# EAGLE design Borne de satisfaction V0 (EAGLE 9.5.2)
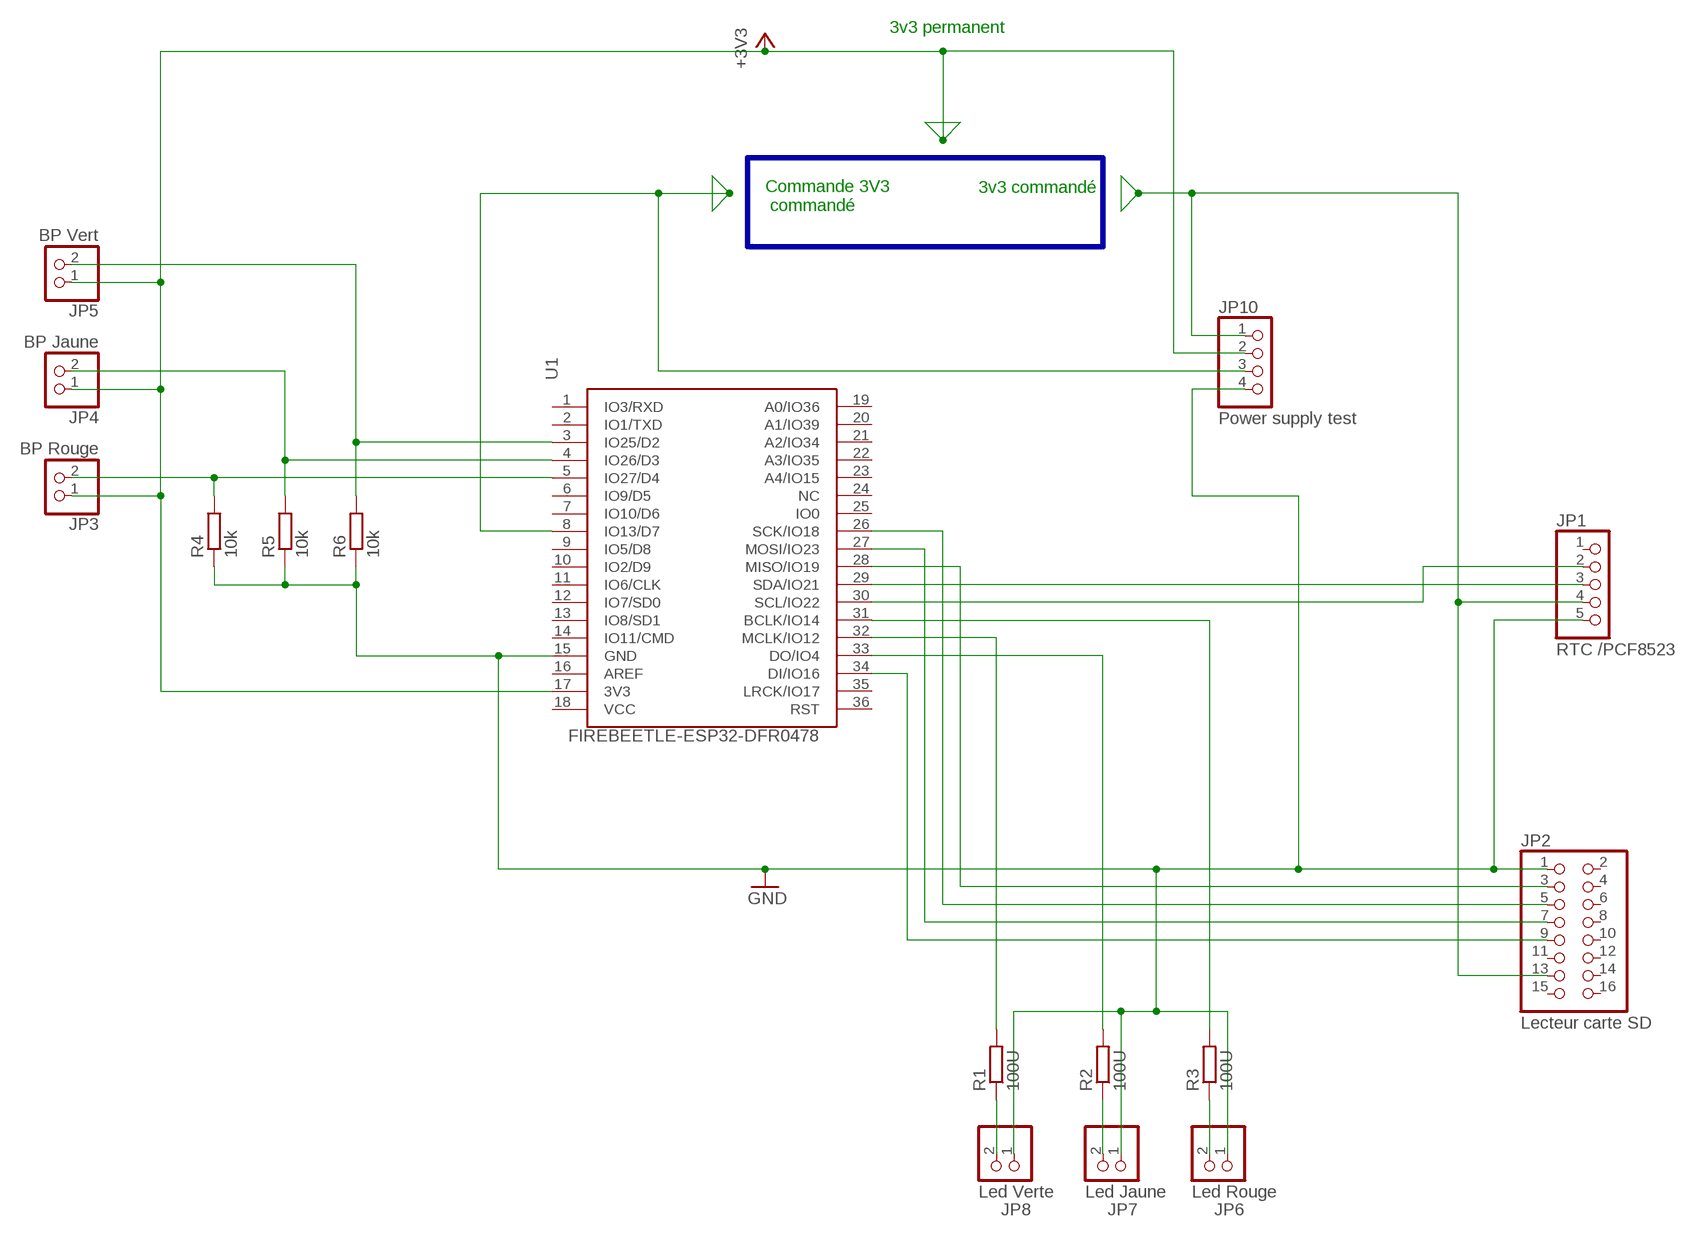
[diagram p0: schematic, sheet 1]

## Parts
JP1  RTC /PCF8523  PINHD-1X5  [1X05]
JP2  Lecteur carte SD  PINHD-2X8  [2X08]
JP3  BP Rouge  PINHD-1X2  [1X02]
JP4  BP Jaune  PINHD-1X2  [1X02]
JP5  BP Vert  PINHD-1X2  [1X02]
JP6  Led Rouge  PINHD-1X2  [1X02]
JP7  Led Jaune  PINHD-1X2  [1X02]
JP8  Led Verte  PINHD-1X2  [1X02]
JP10  Power supply test  PINHD-1X4  [1X04]
R1  100U  R-EU_0207/10  [0207/10]
R2  100U  R-EU_0207/10  [0207/10]
R3  100U  R-EU_0207/10  [0207/10]
R4  10k  R-EU_0207/10  [0207/10]
R5  10k  R-EU_0207/10  [0207/10]
R6  10k  R-EU_0207/10  [0207/10]
U1  FIREBEETLE-ESP32-DFR0478  [FIREBEETLE_ESP32]

## Nets
+3V3: JP3.1 JP4.1 JP5.1 JP10.2 U1.17(3V3)
GND: JP1.5 JP2.1 JP6.1 JP7.1 JP8.1 JP10.4 R4.1 R5.1 R6.1 U1.15(GND)
N$1: JP10.3 U1.8(IO13/D7)
N$2: JP2.3 U1.28(MISO/IO19)
N$3: JP2.5 U1.26(SCK/IO18)
N$4: JP2.7 U1.27(MOSI/IO23)
N$5: JP2.9 U1.34(DI/IO16)
N$6: JP1.4 JP2.13 JP10.1
N$7: JP3.2 R4.2 U1.5(IO27/D4)
N$8: JP1.2 U1.30(SCL/IO22)
N$9: JP1.3 U1.29(SDA/IO21)
N$10: JP8.2 R1.1
N$11: JP7.2 R2.1
N$12: JP6.2 R3.1
N$13: R1.2 U1.32(MCLK/IO12)
N$14: R3.2 U1.31(BCLK/IO14)
N$15: R2.2 U1.33(DO/IO4)
N$17: JP4.2 R5.2 U1.4(IO26/D3)
N$18: JP5.2 R6.2 U1.3(IO25/D2)
Unconnected: JP1.1 JP2.2 JP2.4 JP2.6 JP2.8 JP2.10 JP2.11 JP2.12 JP2.14 JP2.15 JP2.16 U1.1(IO3/RXD) U1.2(IO1/TXD) U1.6(IO9/D5) U1.7(IO10/D6) U1.9(IO5/D8) U1.10(IO2/D9) U1.11(IO6/CLK) U1.12(IO7/SD0) U1.13(IO8/SD1) U1.14(IO11/CMD) U1.16(AREF) U1.18(VCC) U1.19(A0/IO36) U1.20(A1/IO39) U1.21(A2/IO34) U1.22(A3/IO35) U1.23(A4/IO15) U1.24(NC) U1.25(IO0) U1.35(LRCK/IO17) U1.36(RST)

## Buses
B$1

## Notes on the sheet
- 3v3 permanent
- 3v3 commandé
- Commande 3V3
   commandé

## Library data of the parts
JP1 = pinhead:PINHD-1X5: PIN HEADER
JP2 = pinhead:PINHD-2X8: PIN HEADER
JP3-JP8 = pinhead:PINHD-1X2: PIN HEADER
JP10 = pinhead:PINHD-1X4: PIN HEADER
R1-R6 = rcl:R-EU_: RESISTOR, European symbol; SPICEPREFIX: R
U1 = Eagle_UOF_Lib:FIREBEETLE-ESP32-DFR0478: Development Boards & Kits - Wireless FireBeetle ESP32 IOT MCU Source: Datasheet <https://github.com/Robert-MARKII/Document/blob/master/FireBeetle Board-ESP32 User Manual update.pdf>; DESCRIPTION: Development Boards & Kits - Wireless FireBeetle ESP32 IOT MCU; HEIGHT: mm; MANUFACTURER_NAME: DFRobot; MANUFACTURER_PART_NUMBER: DFR0478; MOUSER_PART_NUMBER: 426-DFR0478; MOUSER_PRICE-STOCK: https://www.mouser.co.uk/ProductDetail/DFRobot/DFR0478?qs=EU6FO9ffTwc%252BR65h2NUGQw%3D%3D

## Board
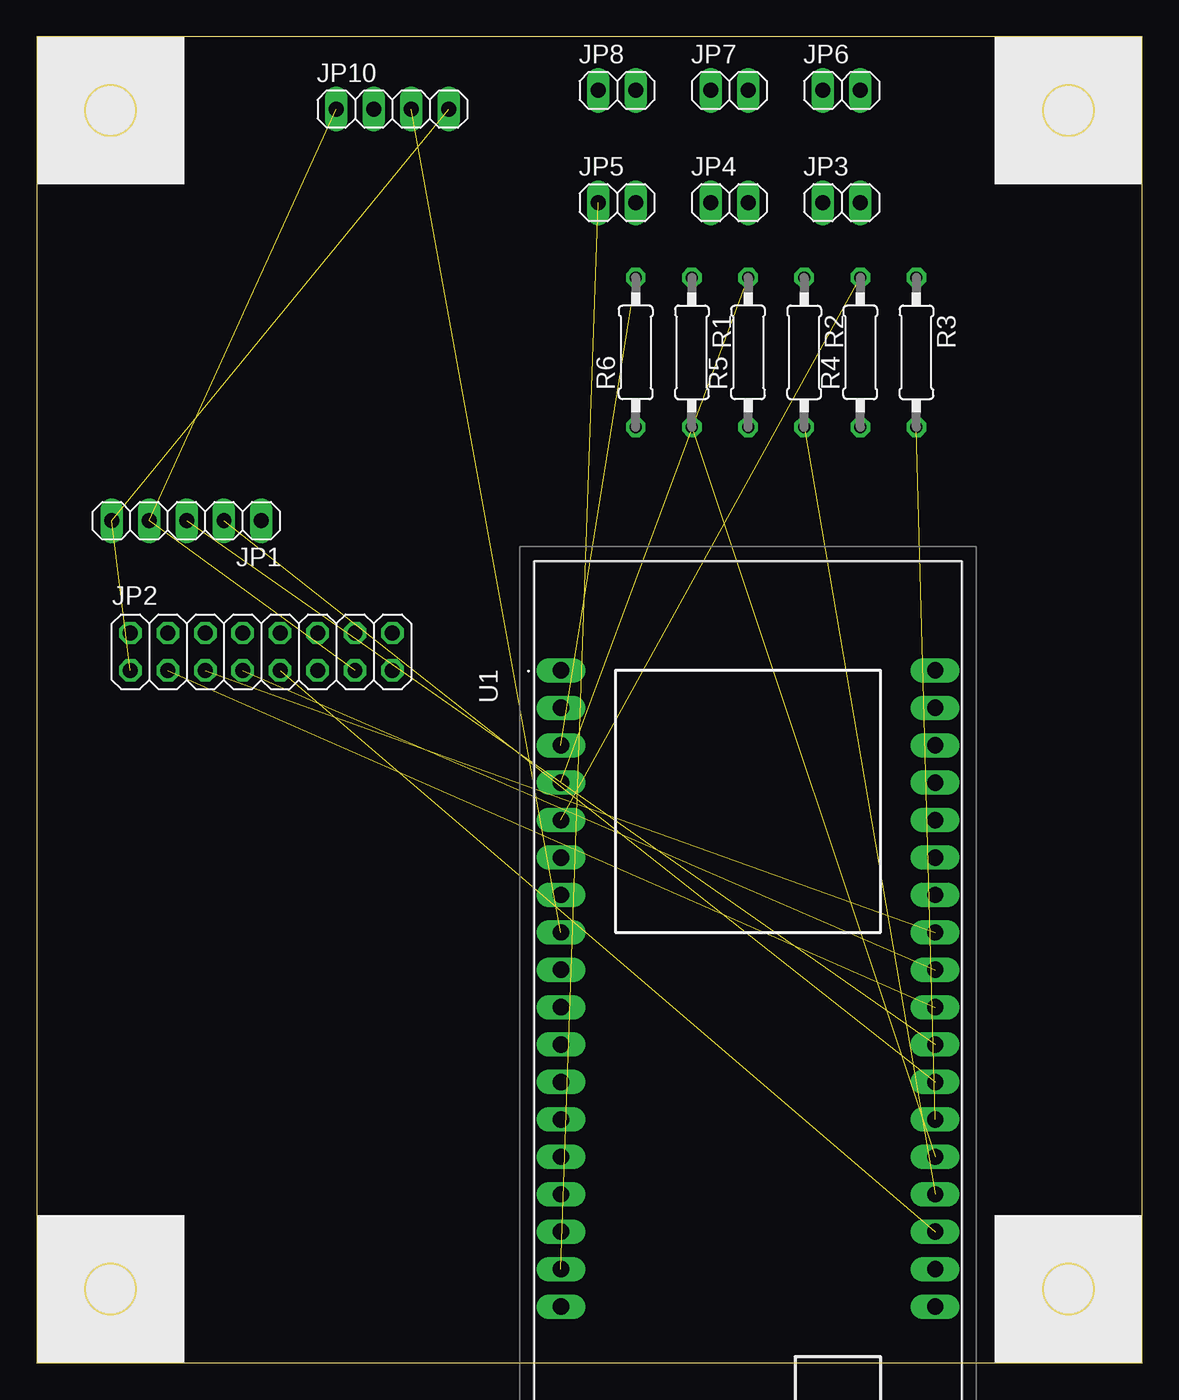
[diagram p1: board, top side]
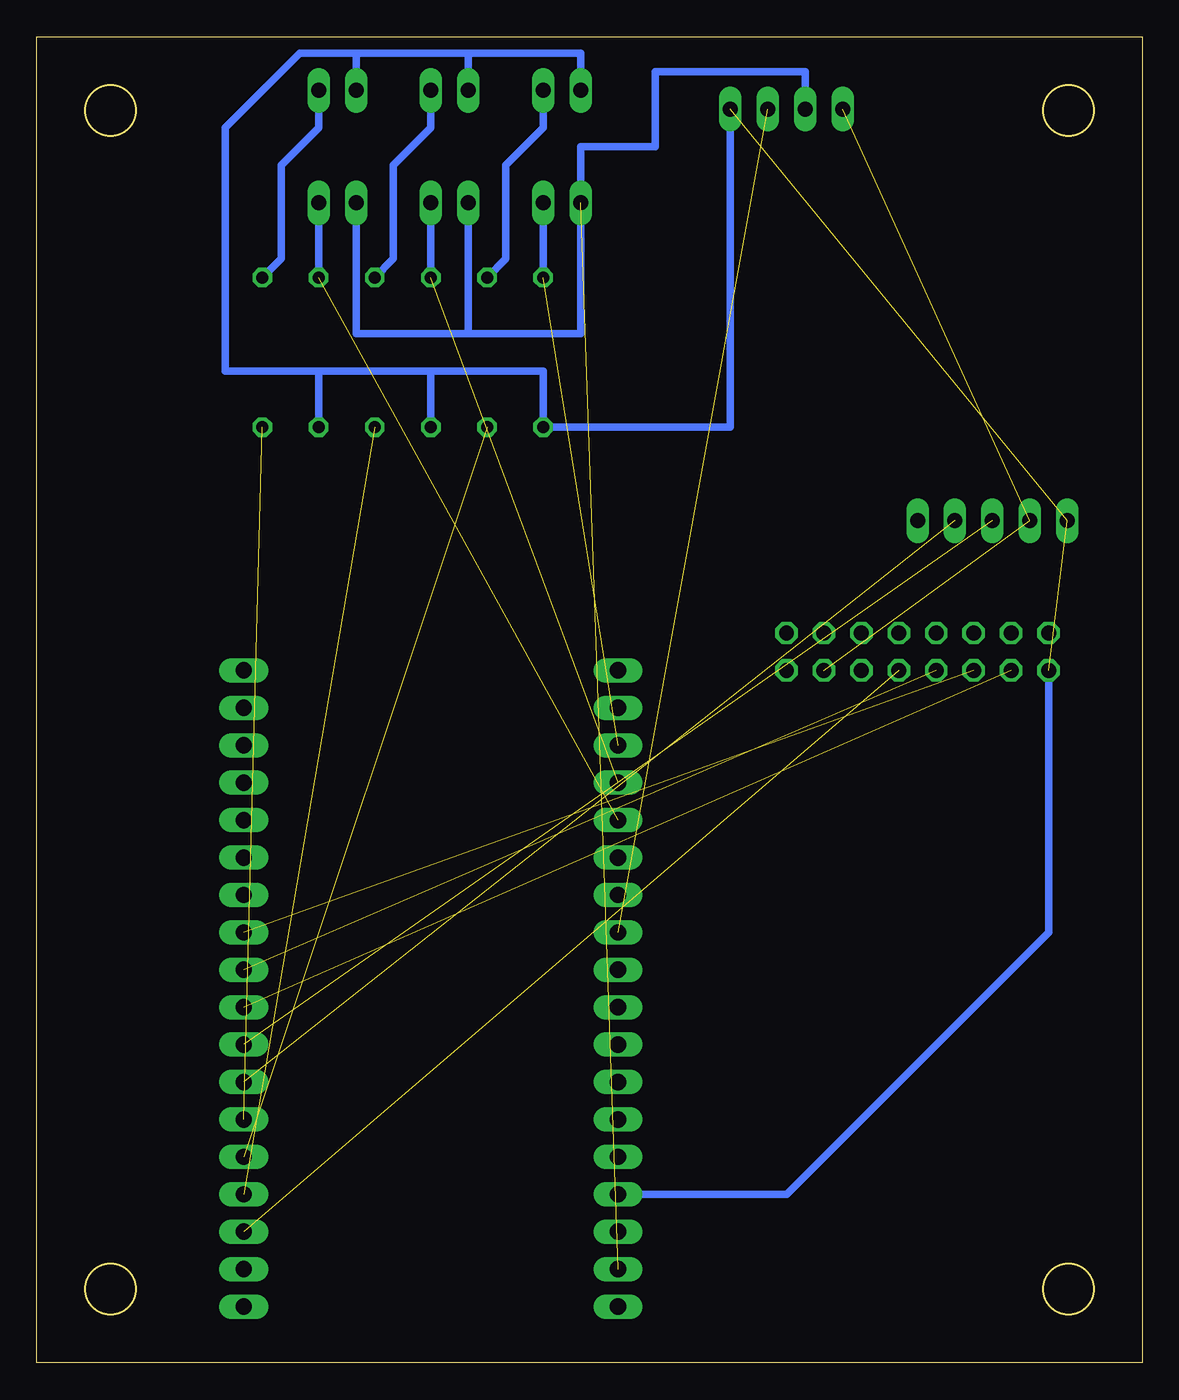
[diagram p2: board, bottom side, seen from below]

Size 75 x 90 mm. Coordinates in mm from the lower left corner, seen from the top.
Outline: 0,0 75,0 75,90 0,90 0,0
Outline: circle at 5,5 radius 1.7
Outline: circle at 70,5 radius 1.7
Outline: circle at 5,85 radius 1.7
Outline: circle at 70,85 radius 1.7
Copper layers (1*16): Top 0.035mm / dielectric 1.5mm / Bottom 0.035mm
Design rules "default": minimum track width 20mil, minimum drill 0.5mm, track to track 20mil, track to pad 20mil, pad to pad 20mil, via to via 20mil, smd to smd 20mil, copper to edge 30mil, drill to drill 20mil, minimum pad ring 10mil, minimum via ring 8mil, stop-mask expansion 4mil, vias tented up to drill 0mil, thermal gap 10mil

### Footprints (pad centres in the part's own frame; a part is rotated, then mirrored left to right if it is on the bottom)
1X05 = drill 1.016 long: 1 -5.08,0; 2 -2.54,0; 3 0,0; 4 2.54,0; 5 5.08,0
2X08 = drill 1.016 octagon: 1 -8.89,-1.27; 2 -8.89,1.27; 3 -6.35,-1.27; 4 -6.35,1.27; 5 -3.81,-1.27; 6 -3.81,1.27; 7 -1.27,-1.27; 8 -1.27,1.27; 9 1.27,-1.27; 10 1.27,1.27; 11 3.81,-1.27; 12 3.81,1.27; 13 6.35,-1.27; 14 6.35,1.27; 15 8.89,-1.27; 16 8.89,1.27
1X02 = drill 1.016 long: 1 -1.27,0; 2 1.27,0
1X04 = drill 1.016 long: 1 -3.81,0; 2 -1.27,0; 3 1.27,0; 4 3.81,0
0207/10 = drill 0.813 octagon: 1 -5.08,0; 2 5.08,0
FIREBEETLE_ESP32 = drill 1.11 pad 1.651 long: 1 25.4,12.7; 2 22.86,12.7; 18 -17.78,12.7 | drill 1.11 pad 1.665 long: 3 20.32,12.7; 4 17.78,12.7; 5 15.24,12.7; 6 12.7,12.7; 7 10.16,12.7; 8 7.62,12.7; 9 5.08,12.7; 10 2.54,12.7; 11 0,12.7; 12 -2.54,12.7; 13 -5.08,12.7; 14 -7.62,12.7; 15 -10.16,12.7; 16 -12.7,12.7; 17 -15.24,12.7; 19 25.4,-12.7; 20 22.86,-12.7; 21 20.32,-12.7; 22 17.78,-12.7; 23 15.24,-12.7; 24 12.7,-12.7; 25 10.16,-12.7; 26 7.62,-12.7; 27 5.08,-12.7; 28 2.54,-12.7; 29 0,-12.7; 30 -2.54,-12.7; 31 -5.08,-12.7; 32 -7.62,-12.7; 33 -10.16,-12.7; 34 -12.7,-12.7; 35 -15.24,-12.7; 36 -17.78,-12.7

### Placement (x,y rotation side)
JP1  10.16,57.15 180 top
JP2  15.24,48.26 0 top
JP3  54.61,78.74 0 top
JP4  46.99,78.74 0 top
JP5  39.37,78.74 0 top
JP6  54.61,86.36 0 top
JP7  46.99,86.36 0 top
JP8  39.37,86.36 0 top
JP10  24.13,85.09 0 top
R1  44.45,68.58 270 top
R2  52.07,68.58 270 top
R3  59.69,68.58 270 top
R4  55.88,68.58 90 top
R5  48.26,68.58 90 top
R6  40.64,68.58 90 top
U1  48.26,21.59 90 top

### Tracks (layer width: path | path; a pad name or v marks a point on that pad's centre or on a via)
+3V3  (1 unrouted)
  Bottom 0.508: 45.72,69.85 38.1,69.85 JP5.1 38.1,82.55 33.02,82.55 33.02,87.63 22.86,87.63 JP10.2 | 45.72,69.85 JP4.1 | 45.72,69.85 53.34,69.85 JP3.1
GND  (2 unrouted)
  Bottom 0.508: JP10.4 27.94,63.5 R6.1 40.64,67.31 48.26,67.31 | 48.26,67.31 R5.1 | 48.26,67.31 55.88,67.31 | R4.1 55.88,67.31 | JP8.1 38.1,88.9 45.72,88.9 | 45.72,88.9 JP7.1 | 45.72,88.9 53.34,88.9 | 53.34,88.9 JP6.1 | 53.34,88.9 57.15,88.9 62.23,83.82 62.23,67.31 55.88,67.31 | JP2.1 6.35,29.21 24.13,11.43 U1.15
N$1  (1 unrouted)
N$2  (1 unrouted)
N$3  (1 unrouted)
N$4  (1 unrouted)
N$5  (1 unrouted)
N$6  (2 unrouted)
N$7  (1 unrouted)
  Bottom 0.508: JP3.2 R4.2
N$8  (1 unrouted)
N$9  (1 unrouted)
N$10
  Bottom 0.508: R1.1 43.18,74.93 43.18,81.28 40.64,83.82 JP8.2
N$11
  Bottom 0.508: R2.1 50.8,74.93 50.8,81.28 48.26,83.82 JP7.2
N$12
  Bottom 0.508: R3.1 58.42,74.93 58.42,81.28 55.88,83.82 JP6.2
N$13  (1 unrouted)
N$14  (1 unrouted)
N$15  (1 unrouted)
N$17  (1 unrouted)
  Bottom 0.508: JP4.2 R5.2
N$18  (1 unrouted)
  Bottom 0.508: JP5.2 R6.2

### Text on the board
Dimension: Taille de PCB définie a respecter autant que faire se peut. | Emplaceents à respecter au mieux. Si non voir avec Alex pour les encombrements | Si impossible, voir avec Alex pour reprendre le support